# EAGLE design antduino (EAGLE 6.1)
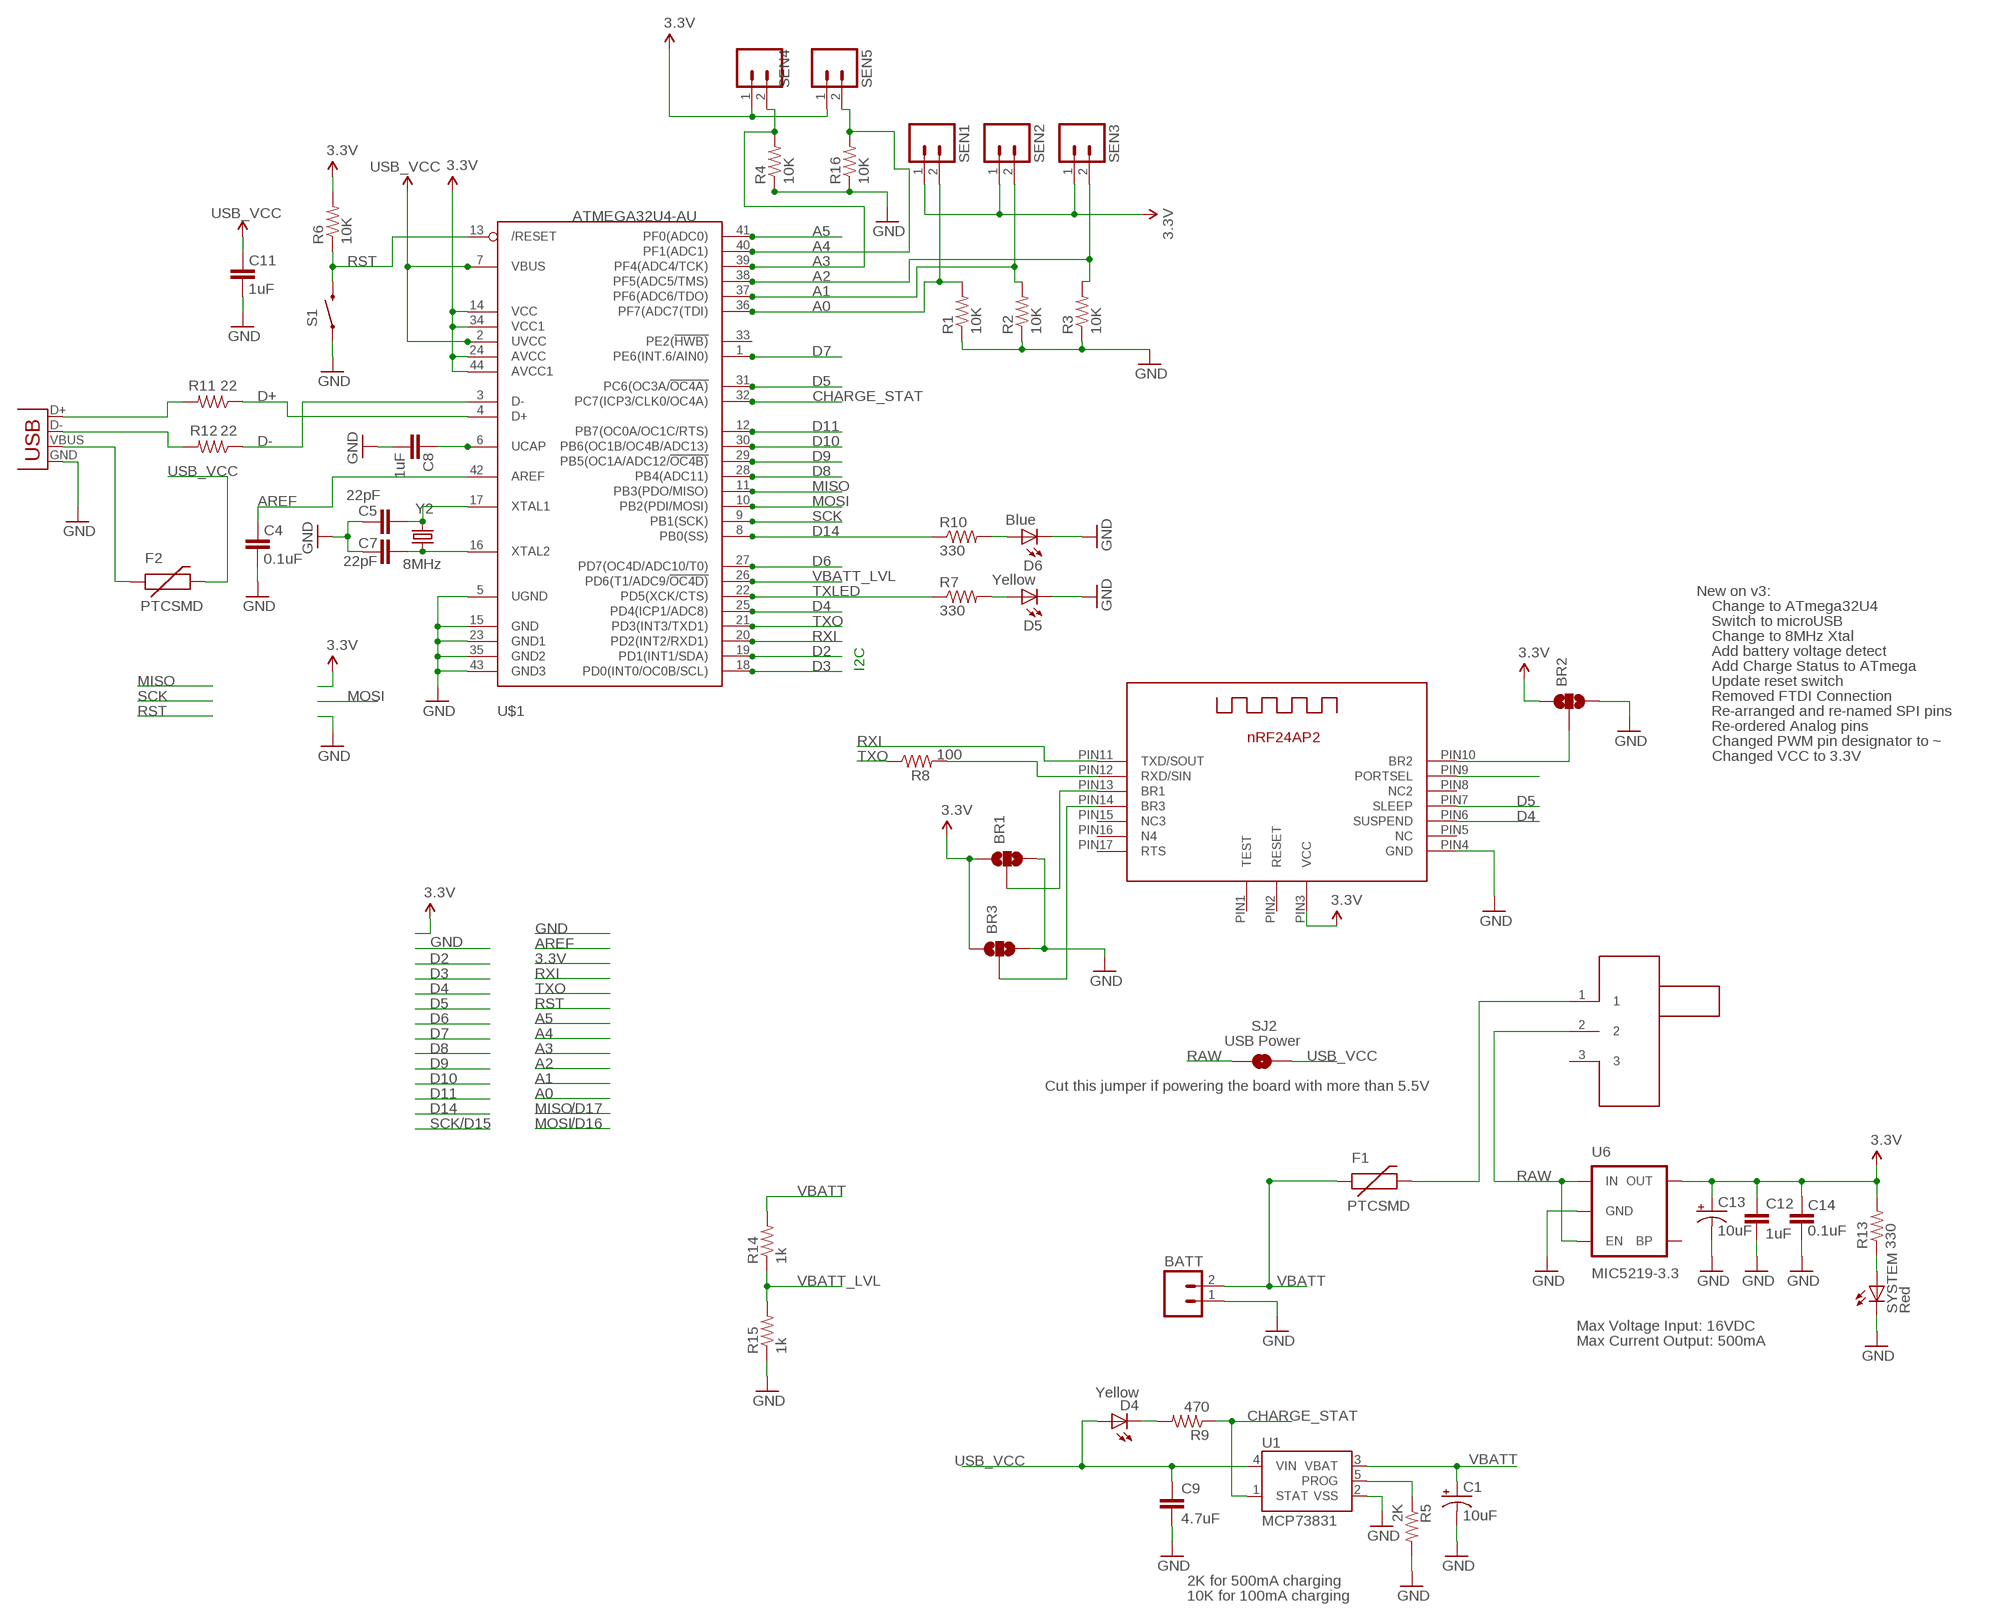
[diagram p0: schematic, sheet 1]

## Parts
BATT  M02PTH  [1X02]
BR1  SOLDERJUMPER_2WAY-OLDS  [SJ_3]
BR2  SOLDERJUMPER_2WAY-OLDS  [SJ_3]
BR3  SOLDERJUMPER_2WAY-OLDS  [SJ_3]
C1  10uF  CAP_POL1206  [EIA3216]
C4  0.1uF  CAP0402-CAP  [0402-CAP]
C5  22pF  CAP0402-CAP  [0402-CAP]
C7  22pF  CAP0402-CAP  [0402-CAP]
C8  1uF  CAP0402-CAP  [0402-CAP]
C9  4.7uF  CAP0402-CAP  [0402-CAP]
C11  1uF  CAP0402-CAP  [0402-CAP]
C12  1uF  CAP0402-CAP  [0402-CAP]
C13  10uF  CAP_POL1206  [EIA3216]
C14  0.1uF  CAP0402-CAP  [0402-CAP]
D4  Yellow  LED0603  [LED-0603]
D5  Yellow  LED0603  [LED-0603]
D6  Blue  LED0603  [LED-0603]
F1  PTCSMD  [PTC-1206]
F2  PTCSMD  [PTC-1206]
R1  10K  RESISTOR0402-RES  [0402-RES]
R2  10K  RESISTOR0402-RES  [0402-RES]
R3  10K  RESISTOR0402-RES  [0402-RES]
R4  10K  RESISTOR0402-RES  [0402-RES]
R5  2K  RESISTOR0402-RES  [0402-RES]
R6  10K  RESISTOR0402-RES  [0402-RES]
R7  330  RESISTOR0402-RES  [0402-RES]
R8  100  RESISTOR0402-RES  [0402-RES]
R9  470  RESISTOR0402-RES  [0402-RES]
R10  330  RESISTOR0402-RES  [0402-RES]
R11  22  RESISTOR0402-RES  [0402-RES]
R12  22  RESISTOR0402-RES  [0402-RES]
R13  330  RESISTOR0402-RES  [0402-RES]
R14  1k  RESISTOR0402-RES  [0402-RES]
R15  1k  RESISTOR0402-RES  [0402-RES]
R16  10K  RESISTOR0402-RES  [0402-RES]
S1  SWITCH-MOMENTARY-2-SMD-1101NE  [TACTILE-SWITCH-1101NE]
SEN1  M02-JST-2MM-SMT  [JST-2-SMD]
SEN2  M02-JST-2MM-SMT  [JST-2-SMD]
SEN3  M02-JST-2MM-SMT  [JST-2-SMD]
SEN4  M02PTH  [1X02]
SEN5  M02PTH  [1X02]
SJ2  USB Power  SOLDERJUMPERTRACE  [SJ_2S-TRACE]
SYSTEM  Red  LED0603  [LED-0603]
U1  MCP73831  [SOT23-5]
U6  MIC5219-3.3  V_REG_LDOSMD  [SOT23-5]
U$1  ATMEGA32U4-AU  [TQFP44]
U$2  DECADE-NRF24AP2-PCB-ANT  [DECADE-NRF24AP2-PCB]
U$4  DECADE-SW-SMALL  [DECADE-SW-SM]
X2  USB-MICROB  [USB-MICROB]
Y2  8MHz  CRYSTAL5X3  [CRYSTAL-SMD-5X3]

## Nets
3.3V [vcc]: BR1.1 BR2.1 BR3.1 C12.1 C13.A(+) C14.2 R6.2 R13.2 SEN1.1 SEN2.1 SEN3.1 SEN4.1 SEN5.1 U6.5(OUT) U$1.14(VCC) U$1.24(AVCC) U$1.34(VCC1) U$1.44(AVCC1) U$2.PIN3(VCC)
A0: R1.2 SEN1.2 U$1.36(PF7(ADC7(TDI))
A1: R2.2 SEN2.2 U$1.37(PF6(ADC6/TDO))
A2: R3.2 SEN3.2 U$1.38(PF5(ADC5/TMS))
A3: R4.2 SEN4.2 U$1.39(PF4(ADC4/TCK))
A4: R16.2 SEN5.2 U$1.40(PF1(ADC1))
A5: U$1.41(PF0(ADC0))
AREF: C4.2 U$1.42(AREF)
CHARGE_STAT: R9.1 U1.1(STAT) U$1.32(PC7(ICP3/CLK0/OC4A))
D2: U$1.19(PD1(INT1/SDA))
D3: U$1.18(PD0(INT0/OC0B/SCL))
D4: U$1.25(PD4(ICP1/ADC8)) U$2.PIN6(SUSPEND)
D5: U$1.31(PC6(OC3A/!OC4A)) U$2.PIN7(SLEEP)
D6: U$1.27(PD7(OC4D/ADC10/T0))
D7: U$1.1(PE6(INT.6/AIN0))
D8: U$1.28(PB4(ADC11))
D9: U$1.29(PB5(OC1A/ADC12/!OC4B))
D10: U$1.30(PB6(OC1B/OC4B/ADC13))
D11: U$1.12(PB7(OC0A/OC1C/RTS))
D14: R10.1 U$1.8(PB0(SS))
D+: R11.1 U$1.4(D+)
D-: R12.1 U$1.3(D-)
GND: BATT.1 BR1.3 BR2.3 BR3.3 C1.C(-) C4.1 C5.2 C7.2 C8.1 C9.2 C11.1 C12.2 C13.C(-) C14.1 D5.C D6.C R1.1 R2.1 R3.1 R4.1 R5.2 R15.1 R16.1 S1.P$1 SYSTEM.C U1.2(VSS) U6.2(GND) U$1.5(UGND) U$1.15(GND) U$1.23(GND1) U$1.35(GND2) U$1.43(GND3) U$2.PIN4(GND) X2.GND
MISO: U$1.11(PB3(PDO/MISO))
MOSI: U$1.10(PB2(PDI/MOSI))
N$2: F2.1 X2.VBUS
N$3: U$2.PIN9(PORTSEL)
N$4: BR2.2 U$2.PIN10(BR2)
N$5: BR1.2 U$2.PIN13(BR1)
N$6: BR3.2 U$2.PIN14(BR3)
N$7: R8.2 U$2.PIN12(RXD/SIN)
N$8: D4.C R9.2
N$9: F1.2 U$4.1
N$11: R5.1 U1.5(PROG)
N$15: D5.A R7.2
N$16: C7.1 U$1.16(XTAL2) Y2.1
N$17: C5.1 U$1.17(XTAL1) Y2.3
N$19: D6.A R10.2
N$20: R12.2 X2.D-
N$21: R11.2 X2.D+
N$38: R13.1 SYSTEM.A
RAW [vcc]: SJ2.1 U6.1(IN) U6.3(EN) U$4.2
RST: R6.1 S1.P$2 U$1.13(/RESET)
RXI: U$1.20(PD2(INT2/RXD1)) U$2.PIN11(TXD/SOUT)
SCK: U$1.9(PB1(SCK))
TXLED: R7.1 U$1.22(PD5(XCK/CTS))
TXO: R8.1 U$1.21(PD3(INT3/TXD1))
UCAP: C8.2 U$1.6(UCAP)
USB_VCC: C9.1 C11.2 D4.A F2.2 SJ2.2 U1.4(VIN) U$1.2(UVCC) U$1.7(VBUS)
VBATT: BATT.2 C1.A(+) F1.1 R14.2 U1.3(VBAT)
VBATT_LVL: R14.1 R15.2 U$1.26(PD6(T1/ADC9/!OC4D))
Unconnected: U6.4(BP) U$1.33(PE2(!HWB)) U$2.PIN1(TEST) U$2.PIN2(RESET) U$2.PIN5(NC) U$2.PIN8(NC2) U$2.PIN15(NC3) U$2.PIN16(N4) U$2.PIN17(RTS) U$4.3

## Notes on the sheet
- New on v3:
- Change to ATmega32U4
- Switch to microUSB
- Change to 8MHz Xtal
- Add battery voltage detect
- I2C | Add Charge Status to ATmega
- Update reset switch
- Removed FTDI Connection
- Re-arranged and re-named SPI pins
- Re-ordered Analog pins
- Changed PWM pin designator to ~
- Changed VCC to 3.3V
- Cut this jumper if powering the board with more than 5.5V
- /D17
- /D15 | /D16
- Max Voltage Input: 16VDC
- Max Current Output: 500mA
- 2K for 500mA charging
- 10K for 100mA charging

## Library data of the parts
BATT SEN1-SEN5 = SparkFun:M02: Header 2 Standard 2-pin 0.1" header. Use with straight break away headers (SKU : PRT-00116), right angle break away headers (PRT-00553), swiss pins (PRT-00743), machine pins (PRT-00117), and female headers (PRT-00115). Molex polarized connector foot print use with SKU : PRT-08233 with associated crimp pins and housings.
BR1-BR3 = SparkFun-Passives:SOLDERJUMPER_2WAY-OLD: Solder Jumper 2 way solder jumper
C1 C13 = SparkFun:CAP_POL: Capacitor Polarized These are standard SMD and PTH capacitors. Normally 10uF, 47uF, and 100uF in electrolytic and tantalum varieties. Always verify the external diameter of the through hole cap, it varies with capacity, voltage, and manufacturer. The EIA devices should be standard.
C4 C5 C7-C9 C11 C12 C14 = SparkFun:CAP: Capacitor Standard 0603 ceramic capacitor, and 0.1" leaded capacitor.
D4-D6 SYSTEM = SparkFun:LED: LEDs Standard schematic elements and footprints for 5mm, 3mm, 1206, and 0603 sized LEDs. 5mm - Spark Fun Electronics SKU : COM-00529 (and others)
F1 F2 = SparkFun:PTC: Resettable Fuse PTC Resettable Fuse. Spark Fun Electronics SKU : COM-08357
R1-R16 = SparkFun:RESISTOR: Resistor Basic schematic elements and footprints for 0603, 1206, and PTH resistors.
S1 = SparkFun-Electromechanical:SWITCH-MOMENTARY-2: Various NO switches- pushbuttons, reed, etc
SJ2 = SparkFun:SOLDERJUMPER: Solder Jumper Standard SMD solder jumper. Used to automate production. Two varients : Normally Open and Normally Closed are the same, but have different paste layers. NC will have a large amount of paste and should jumper during reflow.
U1 = SparkFun:MCP73831: Microchip's MCP73831 Miniature single cell, fully integrated Li-Ion, Li-polymer charge management controller http://ww1.microchip.com/downloads/en/DeviceDoc/21984a.pdf
U6 = SparkFun:V_REG_LDO: Voltage Regulator LDO Standard 150mA LDO voltage regulator in SOT-23 layout. Micrel part MIC5205. BP (by-pass) pin is used to lower output noise with 470pF cap.
U$1 = adafruit:ATMEGA32U4: http://www.ladyada.net/library/eagle
U$2 = DECADE-libraries:DECADE-NRF24AP2-PCB-ANT
U$4 = DECADE-libraries:DECADE-SW-SMALL
X2 = SparkFun:USB: USB Connectors USB-B-PTH is fully proven SKU : PRT-00139 USB-miniB is fully proven SKU : PRT-00587 USB-A-PCB is untested. USB-A-H is throughly reviewed, but untested. Spark Fun Electronics SKU : PRT-00437 USB-B-SMT is throughly reviewed, but untested. Needs silkscreen touching up. USB-A-S has not been used/tested USB-MB-H has not been used/tested
Y2 = SparkFun:CRYSTAL: Crystals Various standard crystals. Proven footprints. Spark Fun Electronics SKU : COM-00534

## Net classes
0 Default: width 0.203 mm
2 LEDPower: width 0.203 mm
3 ButtonSignal: width 0.203 mm

## Board
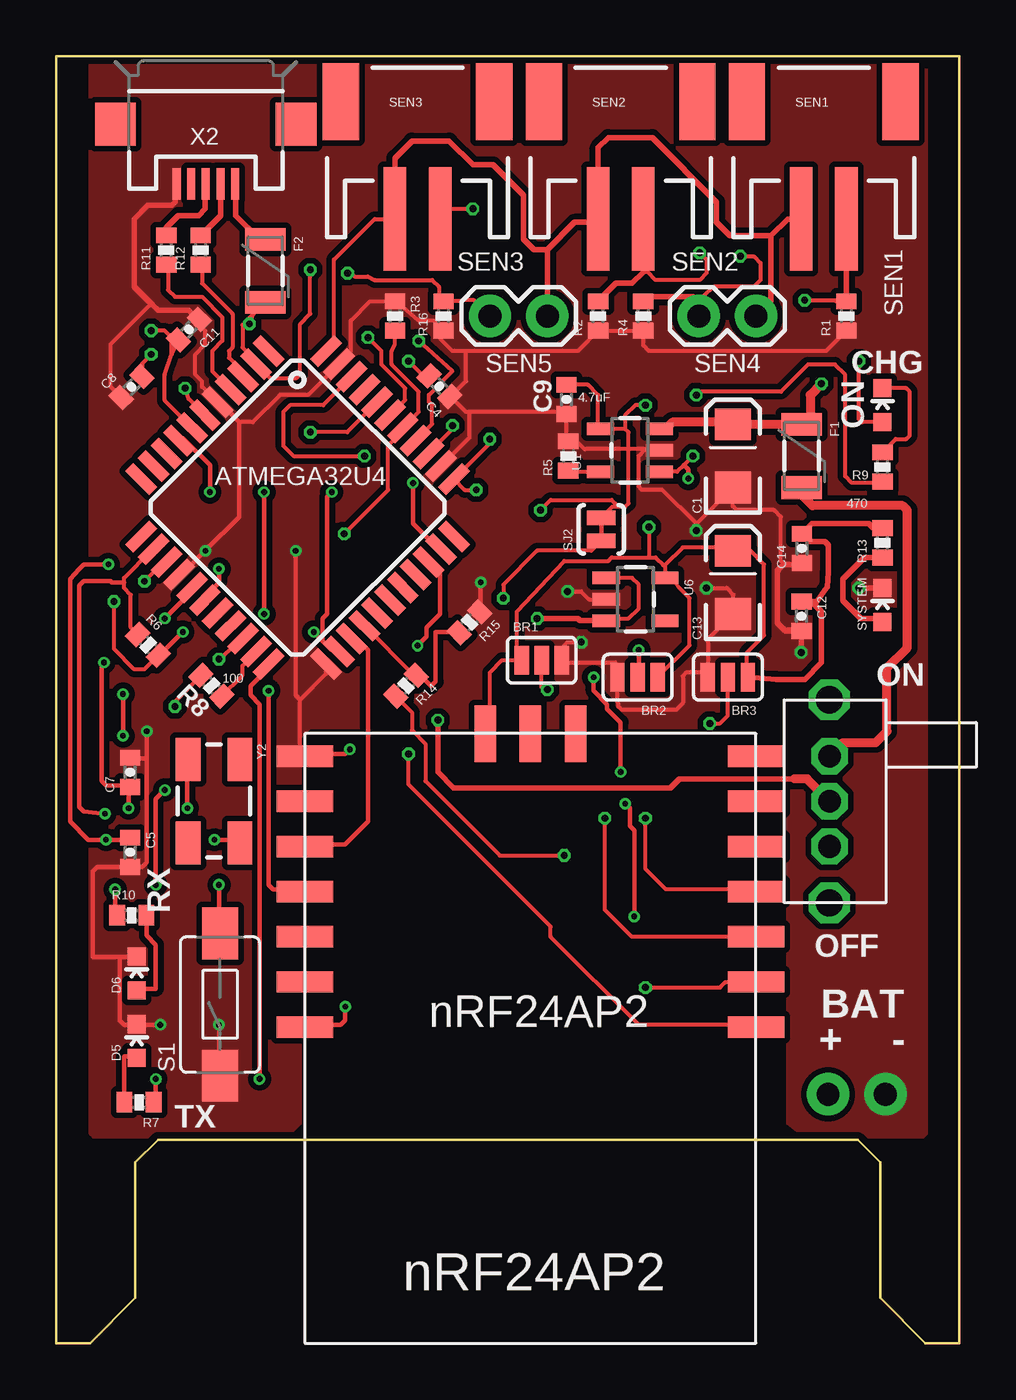
[diagram p1: board, top side]
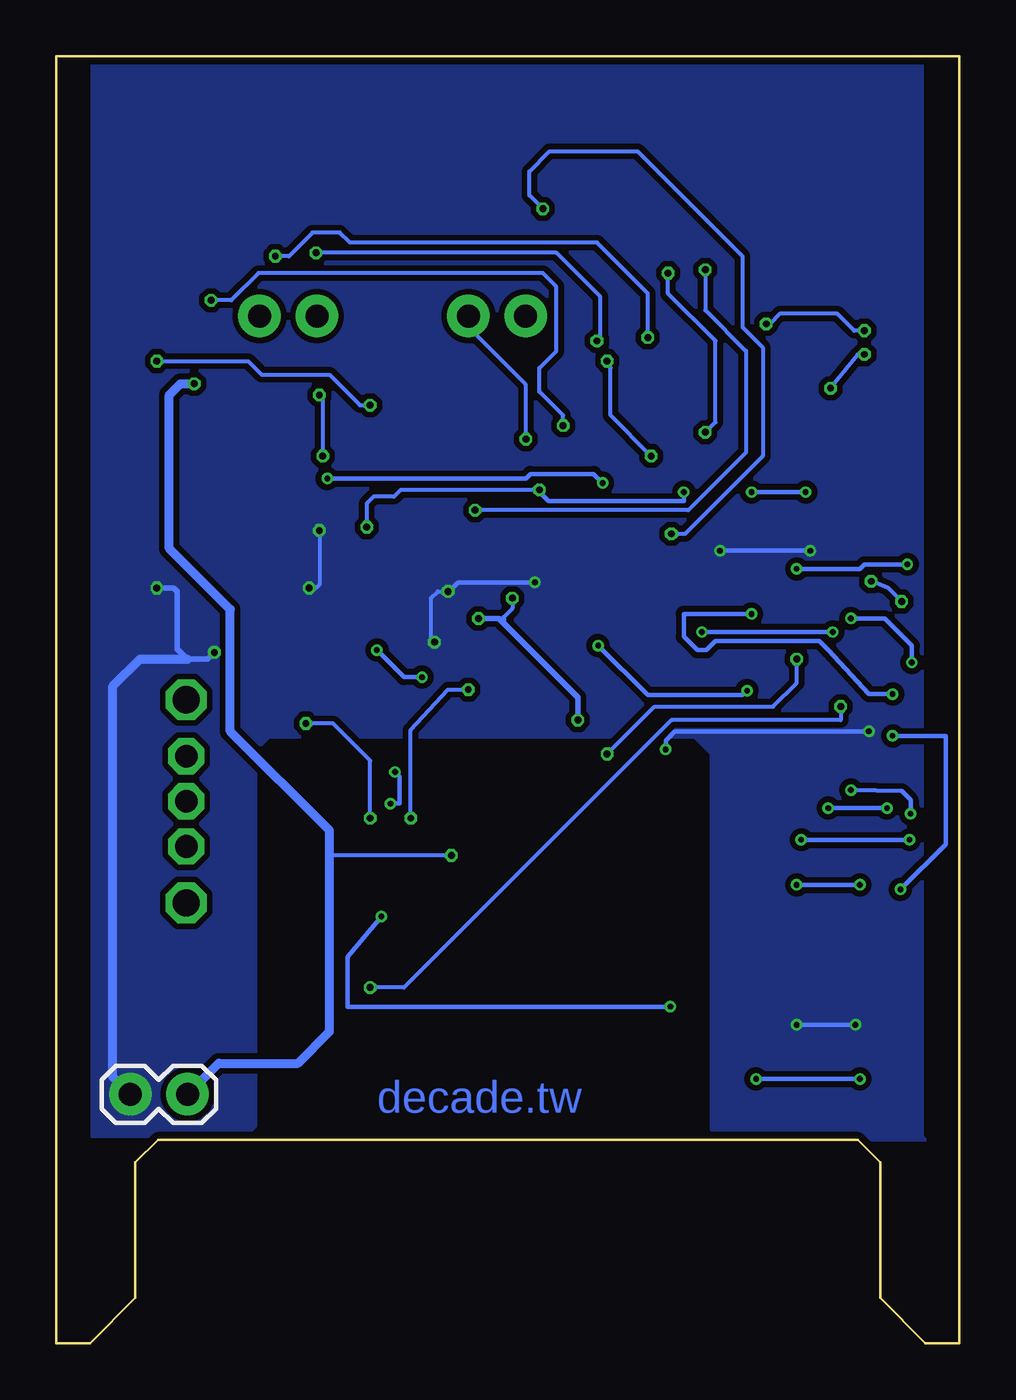
[diagram p2: board, bottom side, seen from below]

Size 40 x 57 mm. Coordinates in mm from the lower left corner, seen from the top.
Outline: 40,0 40,57 0,57 0,0 1.5,0 3.5,2 3.5,8 4.5,9 35.5,9 36.5,8 36.5,2 38.5,0 40,0
Copper layers (1*16): Top 0.035mm / dielectric 1.5mm / Bottom 0.035mm
Design rules: minimum track width 12mil, minimum drill 12mil, track to track 10mil, track to pad 10mil, pad to pad 10mil, via to via 10mil, smd to smd 10mil, copper to edge 12mil, drill to drill 15mil, minimum pad ring 12mil, minimum via ring 5mil, stop-mask expansion 4mil, vias tented up to drill 0mil, thermal gap 10mil

### Footprints (pad centres in the part's own frame; a part is rotated, then mirrored left to right if it is on the bottom)
1X02 = drill 1.016 pad 1.88: 1 0,0; 2 2.54,0
SJ_3 = smd 0.635 x 1.27: 1 -0.889,0; 2 0,0; 3 0.889,0
EIA3216 = smd 1.4 x 1.6: A 1.4,0; C -1.4,0
0402-CAP = smd 0.7 x 0.9: 1 -0.65,0; 2 0.65,0
LED-0603 = smd 0.8 x 0.8: A 0,-0.75; C 0,0.75
PTC-1206 = smd 1 x 1.8: 1 -1.4,0; 2 1.4,0
0402-RES = smd 0.7 x 0.9: 1 -0.65,0; 2 0.65,0
TACTILE-SWITCH-1101NE = smd 2.3 x 1.6: P$1 -3.15,0; P$2 3.15,0
JST-2-SMD = smd 1 x 4.6: 1 -1,-3.7; 2 1,-3.7 | smd 1.6 x 3.4: NC1 -3.4,1.5; NC2 3.4,1.5
SJ_2S-TRACE = smd 0.635 x 1.27: 1 -0.508,0; 2 0.508,0
SOT23-5 = smd 0.55 x 1.2: 1 -0.95,-1.3; 2 0,-1.3; 3 0.95,-1.3; 4 0.95,1.3; 5 -0.95,1.3
TQFP44 = smd 1.5 x 0.5: 1 -5.8,4; 2 -5.8,3.2; 3 -5.8,2.4; 4 -5.8,1.6; 5 -5.8,0.8; 6 -5.8,0; 7 -5.8,-0.8; 8 -5.8,-1.6; 9 -5.8,-2.4; 10 -5.8,-3.2; 11 -5.8,-4; 23 5.8,-4; 24 5.8,-3.2; 25 5.8,-2.4; 26 5.8,-1.6; 27 5.8,-0.8; 28 5.8,0; 29 5.8,0.8; 30 5.8,1.6; 31 5.8,2.4; 32 5.8,3.2; 33 5.8,4 | smd 0.5 x 1.5: 12 -4,-5.8; 13 -3.2,-5.8; 14 -2.4,-5.8; 15 -1.6,-5.8; 16 -0.8,-5.8; 17 0,-5.8; 18 0.8,-5.8; 19 1.6,-5.8; 20 2.4,-5.8; 21 3.2,-5.8; 22 4,-5.8; 34 4,5.8; 35 3.2,5.8; 36 2.4,5.8; 37 1.6,5.8; 38 0.8,5.8; 39 0,5.8; 40 -0.8,5.8; 41 -1.6,5.8; 42 -2.4,5.8; 43 -3.2,5.8; 44 -4,5.8
DECADE-NRF24AP2-PCB = smd 0.95 x 2.5: PIN1 -2,-10; PIN2 0,-10; PIN3 2,-10 | smd 2.5 x 0.95: PIN4 10,-9; PIN5 10,-7; PIN6 10,-5; PIN7 10,-3; PIN8 10,-1; PIN9 10,1; PIN10 10,3; PIN11 -10,3; PIN12 -10,1; PIN13 -10,-1; PIN14 -10,-3; PIN15 -10,-5; PIN16 -10,-7; PIN17 -10,-9
DECADE-SW-SM = drill 1 octagon: 1 2.5,2; 2 4.5,2; 3 6.5,2 | drill 1.2 octagon: GND 0,2; GND2 9,2
USB-MICROB = smd 0.35 x 1.4: D+ 0,2.65; D- -0.65,2.65; GND 1.3,2.65; ID 0.65,2.65; VBUS -1.3,2.65 | smd 1.8 x 1.9: MT1 -4,0; MT2 4,0
CRYSTAL-SMD-5X3 = smd 1.9 x 1.1: 1 -1.85,-1.15; 2 1.85,-1.15; 3 1.85,1.15; 4 -1.85,1.15

### Placement (x,y rotation side)
BATT  36.73,11.02 0 bottom
BR1  21.5,30.25 0 top
BR2  25.75,29.5 180 top
BR3  29.75,29.5 180 top
C1  29.97,39.3 90 top
C4  16.97,42.39 135 top
C5  3.27,21.74 270 top
C7  3.27,25.28 90 top
C8  3.33,42.36 45 top
C9  22.6,41.8 270 top
C11  5.87,44.9 225 top
C12  33.01,32.2 270 top
C13  29.97,33.7 90 top
C14  33.03,35.2 90 top
D4  36.6,41.55 0 top
D5  3.55,13.38 0 top
D6  3.55,16.38 0 top
F1  33.01,39.3 270 top
F2  9.25,47.5 270 top
R1  35,45.5 90 top
R2  24,45.5 90 top
R3  15,45.5 270 top
R4  26,45.5 90 top
R5  22.68,39.3 90 top
R6  4.06,30.93 315 top
R7  3.66,10.67 180 top
R8  6.87,29.12 135 top
R9  36.6,38.81 90 top
R10  3.34,18.95 0 top
R11  4.87,48.42 90 top
R12  6.39,48.42 90 top
R13  36.6,35.45 90 top
R14  15.49,29.12 225 top
R15  18.3,31.93 225 top
R16  17.15,45.5 90 top
S1  7.25,15 90 top
SEN1  34,53.5 0 top
SEN2  25,53.5 0 top
SEN3  16,53.5 0 top
SEN4  31,45.5 180 top
SEN5  21.75,45.5 180 top
SJ2  24.14,36.05 90 top
SYSTEM  36.6,32.7 0 top
U1  25.41,39.55 90 top
U6  25.66,32.95 270 top
U$1  10.68,37.01 315 top
U$2  21,17 180 top
U$4  32.25,28.5 270 top
X2  6.62,54 180 top
Y2  6.98,24.01 270 top

### Tracks (layer width: path | path; a pad name or v marks a point on that pad's centre or on a via)
3.3V  (via drill 0.25, 0.3)
  Top 0.18: BR3.1 30.6,29.54 30.6,30.6 31.35,31.35 31.35,34.5 30.75,35.1 C13.A 29.82,35.25 27.75,35.25 26.96,34.46 | 26.96,34.46 U6.5 26.96,33.79 27.3,33.9 27.6,33.45 28.05,33 28.05,30.91 BR2.1 | U$1.44 12.3,44.29 12.3,48 14.1,49.8 SEN3.1 | R6.2 3.9,29.85 3.45,29.85 2.55,30.75 v2.55,32.85 | v3.9,33.75 4.76,34.61 U$1.14 | U$2.PIN3 19.2,27.2 19.2,29.7 19.75,30.25 BR1.1 20.4,30.46 20.4,32.4 22.5,34.65 24.45,34.65 24.6,34.8 26.25,34.8 | 26.25,34.8 26.55,34.8 26.89,34.46 26.96,34.46 | v18.6,37.8 18.09,37.8 U$1.34 19.2,39.87 v19.2,40.05 | v26.25,36.15 26.25,34.8
  Top 0.203: v11.4,31.5 11.8,31.1 | 11.8,31.1 12.2,30.7 12.4,30.7 U$1.24 | v5.6,31.5 4.6,30.5 R6.2 | 11.8,31.1 11.8,32.1 12,32.3 12,37.5 v12.2,37.7
  Top 0.254: R13.2 36.2,36.1 36,36.3 33.48,36.3 C14.2 33.38,35.5 34.05,35.5 34.2,35.35 34.2,34.15 34.15,33.5 34.05,33.35 33.7,32.85 C12.1 33.45,32.85 33.9,32.4 33.9,30.15 33.15,29.4 31.89,29.4 BR3.1 | SEN4.1 31.65,46.15 31.65,49.05 | 31.65,49.05 32.4,49.8 SEN1.1 | 21.75,48.45 22.95,49.65 23.85,49.65 SEN2.1 24,52.95 24.45,53.4 26.4,53.4 29.25,50.55 29.25,49.65 29.85,49.05 31.65,49.05 | 21.75,48.45 SEN5.1 | SEN3.1 15,52.5 15.75,53.25 17.4,53.25 18.45,52.2 19.35,52.2 20.7,50.85 20.7,48.9 21.15,48.45 21.75,48.45
  Bottom 0.18: v2.55,32.85 3.15,33.45 v3.9,33.75 | v18.6,37.8 24.75,37.8 25.05,37.5 25.95,37.5 26.25,37.2 v26.25,36.15 | v19.2,40.05 19.2,42.45 21.75,45 SEN5.1
  Bottom 0.203: v5.6,31.5 v11.4,31.5 | v12.2,37.7 12.2,37.3 18.2,37.3 18.6,37.7 v18.6,37.8
A0  (via drill 0.3)
  Top 0.18: U$1.36 17.55,40.49 v17.55,40.65 | v33.15,46.2 34.5,46.2 34.55,46.15 R1.2
  Top 0.254: SEN1.2 R1.2
  Bottom 0.18: v17.55,40.65 17.55,41.1 18.6,42.15 18.6,43.2 17.85,43.95 17.85,46.8 18.45,47.4 31.05,47.4 32.25,46.2 v33.15,46.2
A1  (via drill 0.3)
  Top 0.18: U$1.37 16.65,40.72 16.65,41.55 16.5,41.7 16.5,42 17.55,43.05 v16.05,44.4 | v28.5,48.3 28.8,48 28.8,47.4 28.5,47.1 26.55,47.1 26.2,47.45 26,47.45
  Top 0.254: R2.2 24.8,46.95 25.5,46.95 26,47.45 SEN2.2
  Bottom 0.18: v16.05,44.4 15.9,44.55 15.9,46.35 17.85,48.3 v28.5,48.3
A2  (via drill 0.3)
  Top 0.18: R3.2 15,44.25 14.85,43.95 14.85,43.35 16.05,42.15 16.05,41.25 U$1.38 15.35,40.4 14.7,39.75 14.7,37.8 v12.75,35.85 | SEN3.2 17.45,50.25 v18.45,50.25
  Bottom 0.18: v18.45,50.25 19.05,50.85 19.05,51.9 18.15,52.8 14.25,52.8 9.6,48.15 9.6,45 8.7,44.1 8.7,39.3 12.15,35.85 v12.75,35.85
A3  (via drill 0.3)
  Top 0.18: U$1.39 15.45,41.78 15.45,42.3 14.4,43.35 14.4,43.95 v13.8,44.55 | v30.3,48.15 30.9,48.15 31.2,47.85 31.2,47.1 30.9,46.8 29.1,46.8 28.65,46.35 28.65,46.2 28.5,46.05 | 28.5,46.05 28.5,45.75 | 27.9,46.35 28.2,46.05 28.5,46.05
  Top 0.254: R4.2 26.2,46.35 27.9,46.35 28.2,46.35 28.46,46.09 SEN4.2
  Bottom 0.18: v13.8,44.55 13.8,46.5 16.05,48.75 27,48.75 27.45,49.2 28.65,49.2 29.7,48.15 v30.3,48.15
A4  (via drill 0.3)
  Top 0.18: U$1.40 12.89,40.35 v11.25,40.35 | v12.9,47.4 13.05,47.4 13.2,47.25 13.8,47.25 14.1,47.1 16.65,47.1 16.95,46.8 16.95,46.2 | SEN5.2 18.51,46.2 18,46.2 17.95,46.15 R16.2 16.95,46.2 | 16.95,46.2 16.95,46.05
  Bottom 0.18: v11.25,40.35 10.8,40.8 10.8,44.4 12.9,46.5 v12.9,47.4
AREF  (via drill 0.3)
  Top 0.18: U$1.42 11.83,41.55 10.35,41.55 10.05,41.25 10.05,39.75 10.5,39.3 v13.65,39.3 | v15.6,43.5 16.25,42.85 C4.2
  Bottom 0.18: v13.65,39.3 15.45,41.1 15.45,43.2 15.6,43.35 v15.6,43.5
CHARGE_STAT  (via drill 0.25, 0.3)
  Top 0.18: R9.1 36.54,38.1 35.25,38.1 34.95,38.4 34.95,42.9 34.5,43.35 33.3,43.35 32.1,42.15 28.5,42.15 v28.35,42 | v28.2,39.3 27.8,38.9 27.5,38.6 U1.1
  Top 0.203: v15.8,38.1 15.8,36.3 16.8,35.3 17,35.3 U$1.32 | v28,38.3 28,38.7 27.8,38.9
  Bottom 0.18: v28.35,42 28.2,41.85 v28.2,39.3
  Bottom 0.203: v15.8,38.1 16.2,38.5 19,38.5 19.2,38.3 v28,38.3
D4
  Top 0.203: U$1.25 13.2,31.1 13.4,31.1 13.8,30.7 13.8,23.1 12.8,22.1 11,22.1 U$2.PIN6
D5  (via drill 0.25)
  Top 0.203: v16,30.9 16.4,31.3 16.4,31.7 17,32.3 17,34.3 16.8,34.5 16.6,34.5 U$1.31 | v9.4,28.9 9.4,20.3 9.6,20.1 11,20.1 U$2.PIN7
  Bottom 0.203: v16,30.9 13.8,28.7 9.6,28.7 v9.4,28.9
D14  (via drill 0.25)
  Top 0.203: v2.6,20.1 2.6,19.1 R10.1 | v2.95,28.75 v2.95,26.9 | v9.2,37.7 v9.2,32.3 | v6.8,37.7 6.8,38.9 5.6,40.1 U$1.8
  Bottom 0.203: v2.6,20.1 0.6,22.1 0.6,26.9 v2.95,26.9 | v2.95,28.75 4,28.75 5.8,30.7 6.2,31.1 10.8,31.1 11.2,30.7 11.6,30.7 12.2,31.3 12.2,32.3 v9.2,32.3 | v6.8,37.7 v9.2,37.7
D+
  Top 0.18: R11.1 4.95,47.69 4.95,46.65 5.25,46.35 6.45,46.35 7.35,45.45 7.35,44.4 6.9,43.95 6.9,43.05 U$1.4
D-
  Top 0.18: R12.1 6.45,47.71 6.45,46.95 7.8,45.6 7.8,44.1 7.65,43.95 7.65,43.65 8.28,43.02 U$1.3
GND  (via drill 0.25, 0.3)
  Top 0.18: v23.25,31.05 22.65,31.05 22.5,30.9 22.5,30.36 BR1.3 22.49,30.15 24.75,30.15 24.86,30.04 BR2.3 24.86,28.39 24.9,28.35 24.9,28.2 25.05,28.05 27.45,28.05 27.75,28.35 27.75,29.55 27.9,29.7 28.66,29.7 BR3.3 28.86,31.19 C13.C 29.97,33.12 30,33.15 29.7,33.45 v28.8,33.45 | v22.65,33.3 23.25,33.3 23.6,32.95 U6.2 | 28.35,36.3 28.37,36.3 C1.C 29.97,37.08 30.15,36.9 31.8,36.9 32.1,36.6 32.1,34.65 32.25,34.5 | 28.35,36.3 v28.35,36 | 31.95,34.05 32.1,34.35 32.2,34.5 | C11.1 6.33,45.12 6.6,44.85 6.6,44.25 6.15,43.8 6.15,42.9 6.45,42.6 6.45,42.37 U$1.5 7.22,41.68 7.6,41.3 | C8.1 2.4,42.37 2.4,44.25 4.12,45.98 4.28,45.98 | U$2.PIN4 10.8,26.2 10.8,28.5 11.95,29.65 U$1.23 | R1.1 34.1,43.95 26.25,43.95 26,44.2 R4.1 R2.1 23.1,43.95 18.15,43.95 | 28.35,36.3 26.85,37.8 25.95,37.8 25.8,37.95 25.8,39.3 26.05,39.55 U1.2 26.66,39.6 23.4,39.6 23.05,39.95 R5.2 22.6,40.03 C9.2 22.5,41.25 18.3,41.25 | 18.3,41.25 18.15,41.25 17.47,41.93 | 17.47,41.93 C4.1 | 18.15,43.95 17.55,43.95 17,44.5 R16.1 16.7,45.3 16.05,45.3 15.05,46.15 R3.1 13.9,46.15 13.05,45.3 13.05,43.91 U$1.43 11.14,42 9.9,42 8.7,40.8 8.1,40.8 | 17.47,41.93 18.15,42.61 18.15,43.95 | U$1.35 18.3,40.1 18.3,41.25
  Top 0.203: 2.8,17.1 3.4,17.1 D6.C | 2.8,17.1 2.8,14.3 3,14.1 3.4,14.1 D5.C 3.6,14.1 v4.6,14.1 | 4,25.9 3.4,25.9 C7.2 | 4,25.9 4,21.3 3.8,21.1 3.4,21.1 C5.2 3.2,21.1 1.8,21.1 1.6,20.9 1.6,17.1 2.8,17.1 | v7.2,14.1 7.2,11.9 S1.P$1 | v18.8,33.7 18.8,32.5 R15.1 | U$1.15 5.6,34.1 v6.6,35.1 8.1,36.6 8.1,40.8 7.6,41.3 U$1.5 | 10.8,28.5 10.6,28.7 v10.6,35.1 | v4,27.1 4,25.9 | v13,26.3 12.8,26.1 11,26.1 U$2.PIN4
  Top 0.254: C14.1 32.98,34.5 32.25,34.5 32.2,34.5 31.95,34.25 31.95,34.05 31.95,31.9 32.25,31.6 32.55,31.6 32.3,31.55 C12.2 v33.01,30.61 v33,30.6 | SYSTEM.C v35.55,33.45 | X2.GND 5.25,51.28 5.25,50.55 5.1,50.4 4.05,50.4 3.45,49.8 3.45,46.8 4.28,45.98 4.5,45.75 5.85,45.75 6.24,45.36 C11.1
  Bottom 0.18: v23.25,31.05 23.4,31.2 23.4,33 23.1,33.3 v22.65,33.3 | v28.35,36 28.35,33.6 28.5,33.45 v28.8,33.45
  Bottom 0.203: v4.6,14.1 v7.2,14.1 | v18.8,33.7 22.2,33.7 22.6,33.3 v22.65,33.3 | v6.6,35.1 v10.6,35.1 | v4,27.1 12.6,27.1 13,26.7 v13,26.3
  Bottom 0.254: v35.55,33.45 34.8,33.45 34.65,33.3 34.65,30.75 34.2,30.3 33.3,30.3 v33,30.6
  Bottom 0.406: BATT.1 37.5,11.79 37.5,29.1 36.3,30.3 34.2,30.3
  pour Top (no thermals): 1.65,9.15 10.2,9.15 10.8,9.75 10.8,26.85 11.25,27.3 31.2,27.3 32.4,26.55 32.4,9.75 33.15,9.15 38.4,9.15 38.55,9.3 38.55,56.4 37.95,57 1.65,57 1.5,56.85 1.5,9.3
  pour Bottom (no thermals): 1.5,9 10.5,9 10.95,9.45 10.95,26.1 11.7,26.85 30.6,26.85 31.2,26.25 31.2,9.6 31.65,9.15 38.4,9.15 38.4,56.7 38.25,56.85 1.65,56.85 1.65,9.15
N$2
  Top 0.254: X2.VBUS 7.95,51.32 7.95,49.95 9,48.9 F2.1
N$4  (via drill 0.25)
  Top 0.203: v25.8,30.7 25.8,29.5 BR2.2 | v23.8,29.5 23.8,28.9 24.4,28.3 24.4,28.1 25,27.5 v25,25.3 | v25.2,23.9 25.4,23.7 25.4,22.9 25.6,22.7 v25.6,18.9 | v12.8,14.9 12.8,14.3 12.6,14.1 11,14.1 U$2.PIN10
  Bottom 0.203: v25.8,30.7 24.6,29.5 v23.8,29.5 | v25,25.3 24.8,25.1 24.8,23.9 v25.2,23.9 | v25.6,18.9 27.1,17.1 27.1,14.9 v12.8,14.9
N$5  (via drill 0.3)
  Top 0.18: U$2.PIN13 25.5,18 24.3,19.2 v24.3,23.25 | v21.75,28.95 21.6,29.1 21.6,28.95 21.5,29.05 BR1.2
  Bottom 0.18: v24.3,23.25 24.3,27.15 22.65,28.95 v21.75,28.95
N$6  (via drill 0.3)
  Top 0.18: U$2.PIN14 30.9,20.1 27,20.1 26.1,21 v26.1,23.25 | v28.95,27.45 29.4,27.45 29.75,27.8 BR3.2
  Bottom 0.18: v26.1,23.25 26.1,25.8 27.75,27.45 v28.95,27.45
N$7  (via drill 0.3)
  Top 0.18: R8.2 5.25,28.42 v5.25,28.2 | v26.1,15.75 29.4,15.75 29.65,16 U$2.PIN12
  Bottom 0.18: v5.25,28.2 5.25,27.6 12.75,27.6 24.6,15.75 v26.1,15.75
N$8
  Top 0.18: R9.2 37.19,40.05 37.65,40.05 37.8,40.2 37.8,42.15 37.65,42.3 D4.C
N$9
  Top 0.406: U$4.1 34.85,26.6 36.3,26.6 36.8,27.1 36.8,29.9 37.7,30.8 37.7,36.9 37.5,37.1 33.5,37.1 33.01,37.59 F1.2
N$11
  Top 0.18: R5.1 22.73,38.6 U1.5
N$15
  Top 0.203: D5.A 3.4,12.7 3,12.7 3,10.7 R7.2
N$16  (via drill 0.25)
  Top 0.203: v3.2,23.7 3.2,24.5 C7.1 3.2,24.7 2.2,24.7 2,24.9 2,29.95 v2.1,30.15 | v5.8,23.7 5.8,25.7 Y2.1 | v4.8,32.1 6,33.3 U$1.16
  Bottom 0.203: v5.8,23.7 v3.2,23.7 | v2.1,30.15 2.1,30.9 3.3,32.1 v4.8,32.1
N$17  (via drill 0.25)
  Top 0.203: v7,22.3 8,22.3 Y2.3 | C5.1 3.2,22.3 v2.2,22.3 1.4,22.3 0.6,23.1 0.6,33.85 1,34.3 1.2,34.5 v2.3,34.5 | v7.2,34.3 7.2,33.7 6.6,33.1 U$1.17
  Bottom 0.203: v7,22.3 v2.2,22.3 | v7.2,34.3 4.4,34.3 4.2,34.5 v2.3,34.5
N$19
  Top 0.203: D6.A 3.6,15.7 4.4,15.7 4.4,17.65 4,18.05 4,18.9 R10.2
N$20
  Top 0.254: R12.2 7.27,49.95 X2.D-
N$21
  Top 0.254: X2.D+ 6.6,51.33 6.6,50.25 6.3,49.95 5.4,49.95 4.87,49.42 R11.2
N$38
  Top 0.254: SYSTEM.A 36.45,32.1 35.65,32.1 34.85,32.9 34.85,33.85 35.8,34.8 R13.1
RAW  (via drill 0.3)
  Top 0.18: U6.3 24.46,32.1 25.35,32.1 25.8,32.55 25.8,33.6 25.5,33.9 U6.1 | SJ2.1 23.7,35.1 21.3,35.1 19.8,33.6 v19.8,33
  Top 0.254: 32.7,25 27.6,25 27.2,24.6 17.6,24.6 16.9,25.3 v16.9,27.6 | v21.3,32.1 23.1,32.1 23.2,32 U6.3
  Top 0.406: U$4.2 33.25,25 32.7,25
  Bottom 0.18: v19.8,33 19.8,32.55 20.18,32.17 20.18,31.88
  Bottom 0.254: v16.9,27.6 16.9,28.6 20.18,31.88 20.4,32.1 v21.3,32.1
RST  (via drill 0.25)
  Top 0.18: R6.1 3.3,31.69 3.3,33.15 3,33.45 3,33.7 3,33.9 4.2,35.1 4.35,35.1
  Top 0.203: 4.2,35.1 U$1.13 | 3,33.7 2.45,33.7 2.4,33.75 1.2,33.75 1,33.55 1,23.75 1.2,23.55 v2.15,23.45 | v4.8,24.5 4.4,24.1 v4.4,20.3 | v7.2,20.3 7.2,18.3 S1.P$2
  Bottom 0.203: v4.8,24.5 2.55,24.45 2.15,24.05 v2.15,23.45 | v7.2,20.3 v4.4,20.3
RXI  (via drill 0.3)
  Top 0.18: U$2.PIN11 30.9,14.1 25.8,14.1 21.9,18 21.9,18.45 15.6,24.75 v15.6,26.1 | v7.2,30.3 8.26,31.21 U$1.20
  Bottom 0.18: v15.6,26.1 13.5,28.2 8.25,28.2 7.2,29.25 v7.2,30.3
TXLED  (via drill 0.25)
  Top 0.203: v4.4,11.7 4.4,10.7 R7.1 | v9,11.7 9,28.3 8.6,28.7 8.6,29.1 9.4,29.9 U$1.22
  Bottom 0.203: v9,11.7 v4.4,11.7
TXO
  Top 0.18: R8.1 8.25,29.58 8.25,30 8.84,30.59 U$1.21
UCAP  (via drill 0.3)
  Top 0.18: U$1.6 5.85,41.84 v5.7,42.3 | v4.2,43.8 3.79,43.39 C8.2
  Bottom 0.18: v5.7,42.3 4.5,43.8 v4.2,43.8
USB_VCC  (via drill 0.3)
  Top 0.18: U$1.7 4.8,41.76 4.8,42.9 5.11,43.81 | 5.11,43.81 C11.2 | F2.2 8.72,45.58 | 8.72,45.58 8.25,45.1 8.25,44.1 8.84,43.51 U$1.2 9.46,42.75 10.65,42.75 10.8,42.9 10.8,45.15 11.25,45.6 v11.25,47.55 | 5.11,43.81 5.1,43.82 5.1,44.55 4.8,44.85 v4.2,44.85 | v8.55,45.15 8.72,45.58 | SJ2.2 24.63,37.05 24.75,37.05 | 25.2,40.5 U1.4 | U1.4 24,40.61 | 24,40.61 24,42 23.55,42.45 C9.1 | D4.A 35.7,40.8 35.55,40.95 v35.55,43.5 | v26.1,41.55 25.65,41.55 25.2,41.1 25.2,40.5 | v21.45,36.9 21.9,37.35 24.6,37.35 24.75,37.2 24.75,37.05 | 24.75,37.05 25.2,37.05 25.35,37.2 25.35,40.35 25.2,40.5 | U1.4 24,40.5 24,40.61
  Bottom 0.18: v4.2,44.85 4.65,44.85 5.4,45.6 7.95,45.6 8.4,45.15 v8.55,45.15 | v35.55,43.5 31.5,43.5 30.9,42.9 27.9,42.9 26.55,41.55 v26.1,41.55 | v11.25,47.55 11.25,45.75 9.45,43.95 9.45,39.45 12,36.9 v21.45,36.9
VBATT  (via drill 0.3)
  Top 0.18: R14.2 15.75,27.94 15.75,27.15 16.35,26.55 16.35,24.9 19.65,21.6 v22.5,21.6
  Top 0.406: v33.9,42.5 33.4,42 33.4,41.1 F1.1 C1.A 29.87,40.8 27.3,40.8 27,40.5 U1.3
  Bottom 0.18: v22.5,21.6 27.9,21.6
  Bottom 0.406: BATT.2 32.81,12.4 29.3,12.4 27.9,13.8 27.9,21.6 27.9,22.7 32.3,27.1 32.3,32.5 35,35.2 35,42 34.5,42.5 v33.9,42.5
VBATT_LVL
  Top 0.18: U$1.26 15.85,29.58 R14.1
  Top 0.203: R15.2 17.8,31.5 16.8,31.5 16.8,29.3 16.6,29.1 16,29.7 R14.1

### Text on the board
Bottom: decade.tw
tPlace: SEN3 | SEN2 | SEN1 | SEN5 | SEN4 | CHG | 4.7uF | ON | ATMEGA32U4 | R9 | 470 | 100 | ON | RX | OFF | BAT | nRF24AP2 | + | - | TX